# Altium schematic sheet Sheet1.SchDoc
size A
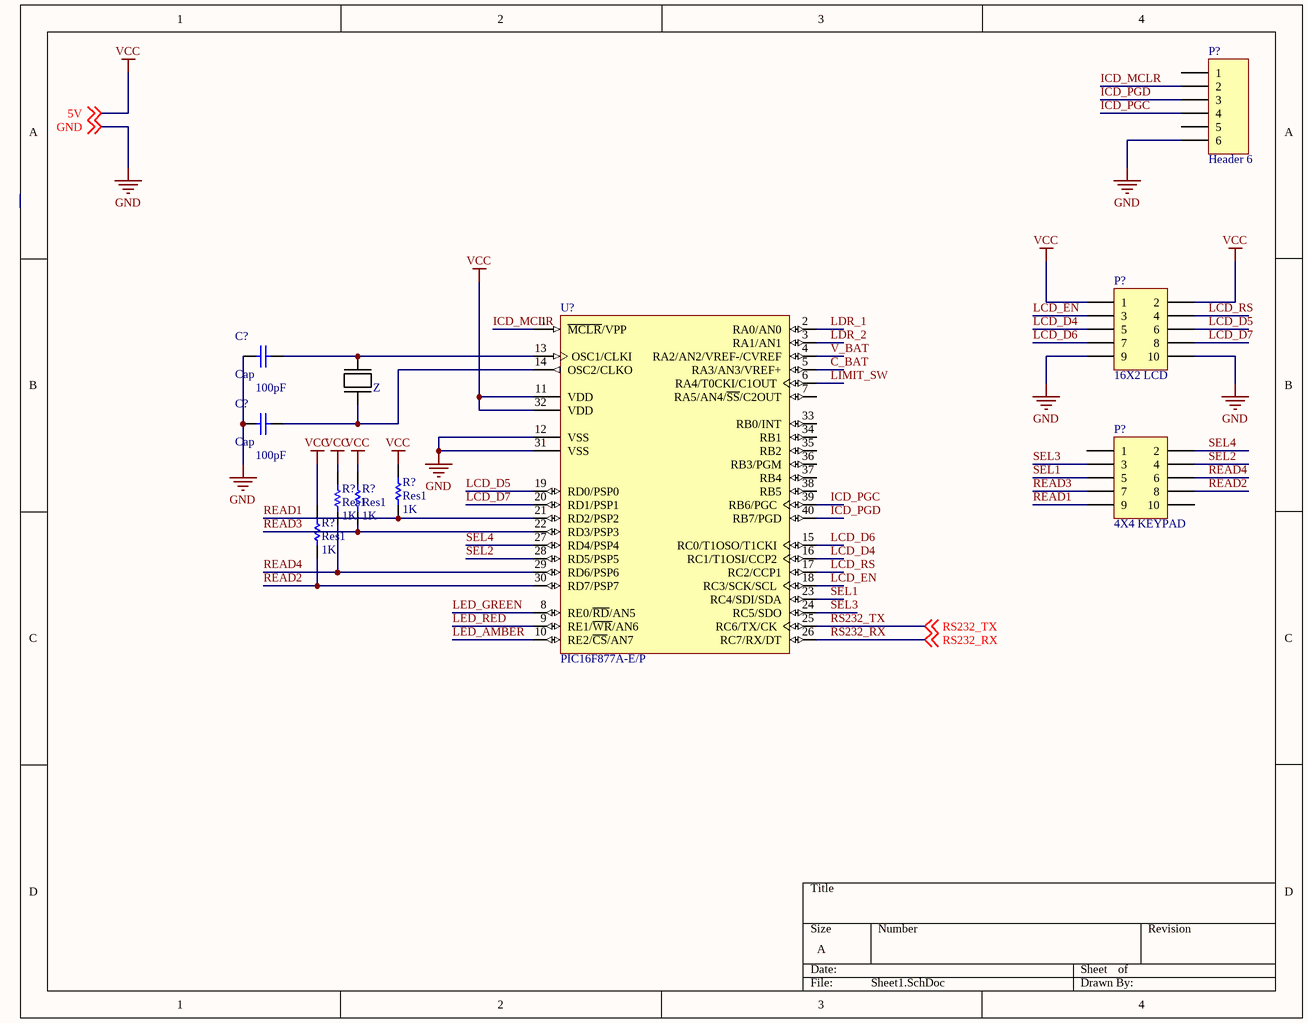
[diagram p0: Sheet1.SchDoc]

## Parts
(Parts that share a designator on the sheet are numbered #1, #2 ... from top to bottom, then left to right.)
C?#1  Cap  value 100pF  [RAD-0.3]
C?#2  Cap  value 100pF  [RAD-0.3]
P?#1  Header 6  [HDR1X6]
P?#2  16X2 LCD  [HDR2X5]
P?#3  4X4 KEYPAD  [HDR2X5]
R?#1  Res1  value 1K  [AXIAL-0.3]
R?#2  Res1  value 1K  [AXIAL-0.3]
R?#3  Res1  value 1K  [AXIAL-0.3]
R?#4  Res1  value 1K  [AXIAL-0.3]
U?  PIC16F877A-E/P  [PDIP600-P40]
Z  CRYSTAL  (value not drawn)

## Nets
GND: C?#1.1 C?#2.1 P?#1.6 P?#2.9 P?#2.10 U?.12(VSS) U?.31(VSS) ; off-sheet GND
VCC: P?#2.1 P?#2.2 R?#1.2 R?#2.2 R?#3.2 R?#4.2 U?.11(VDD) U?.32(VDD) ; off-sheet 5V  [also labelled 5V]
C_BAT: U?.5(RA3/AN3/VREF+)
ICD_MCLR: P?#1.2 U?.1(~{MCLR}/VPP)
ICD_PGC: P?#1.4 U?.39(RB6/PGC)
ICD_PGD: P?#1.3 U?.40(RB7/PGD)
LCD_D4: P?#2.5 U?.16(RC1/T1OSI/CCP2)
LCD_D5: P?#2.6 U?.19(RD0/PSP0)
LCD_D6: P?#2.7 U?.15(RC0/T1OSO/T1CKI)
LCD_D7: P?#2.8 U?.20(RD1/PSP1)
LCD_EN: P?#2.3 U?.18(RC3/SCK/SCL)
LCD_RS: P?#2.4 U?.17(RC2/CCP1)
LDR_1: U?.2(RA0/AN0)
LDR_2: U?.3(RA1/AN1)
LED_AMBER: U?.10(RE2/~{CS}/AN7)
LED_GREEN: U?.8(RE0/~{RD}/AN5)
LED_RED: U?.9(RE1/~{WR}/AN6)
LIMIT_SW: U?.6(RA4/T0CKI/C1OUT)
READ1: P?#3.9 R?#1.1 U?.21(RD2/PSP2)
READ2: P?#3.8 R?#4.1 U?.30(RD7/PSP7)
READ3: P?#3.7 R?#3.1 U?.22(RD3/PSP3)
READ4: P?#3.6 R?#2.1 U?.29(RD6/PSP6)
RS232_RX: U?.26(RC7/RX/DT) ; off-sheet RS232_RX
RS232_TX: U?.25(RC6/TX/CK) ; off-sheet RS232_TX
SEL1: P?#3.5 U?.23(RC4/SDI/SDA)
SEL2: P?#3.4 U?.28(RD5/PSP5)
SEL3: P?#3.3 U?.24(RC5/SDO)
SEL4: P?#3.2 U?.27(RD4/PSP4)
V_BAT: U?.4(RA2/AN2/VREF-/CVREF)
NetC?#1_2: C?#1.2 U?.13(OSC1/CLKI) Z.1
NetC?#2_2: C?#2.2 U?.14(OSC2/CLKO) Z.22

Not connected (* = marked no-connect by the designer): P?#1 1 5; P?#3 1 10; U? 7(RA5/AN4/~{SS}/C2OUT) 33(RB0/INT) 34(RB1) 35(RB2) 36(RB3/PGM) 37(RB4) 38(RB5)

## Library data of the parts
C?#1 C?#2 = Cap: Capacitor; Published: 8-Jun-2000; LatestRevisionDate: 17-Jul-2002; LatestRevisionNote: Re-released for DXP Platform.; PackageReference: RAD-0.3; Publisher: Altium Limited; PackageDescription: Radial Cap, Thru-Hole; 2 Leads; 0.3 in Pin Spacing
P?#1 = Header 6: Header, 6-Pin; LatestRevisionDate: 17-Jul-2002; LatestRevisionNote: Re-released for DXP Platform.; Publisher: Altium Limited
P?#2 P?#3 = Header 5X2: Header, 5-Pin, Dual row; LatestRevisionDate: 17-Jul-2002; LatestRevisionNote: Re-released for DXP Platform.; Publisher: Altium Limited
R?#1-R?#4 = Res1: Resistor; Published: 8-Jun-2000; LatestRevisionDate: 17-Jul-2002; LatestRevisionNote: Re-released for DXP Platform.; PackageReference: AXIAL-0.3; Publisher: Altium Limited; PackageDescription: Axial Device, Thru-Hole; 2 Leads; 0.3 in Pin Spacing
U? = PIC16F877A-E/P: Enhanced FLASH Microcontroller, 8K (x14-Bit words) FLASH, 368 Bytes RAM, 40-Pin PDIP, Standard VDD Range, Extended Temperature; ComponentAvailability: Unknown. Contact manufacturer to determine status.; Published: 11-Oct-2004; LatestRevisionDate: 29-Jan-2009; LatestRevisionNote: Sch. layout revised. 3D Model Removed.; DatasheetVersion: revB, Oct-2003; PackageVersion: revBB, Aug-2009; PackageReference: PDIP600-P40; Publisher: Altium Limited; PackageDescription: 40-Lead Plastic Dual In-Line (P) - 600 mil Body [PDIP]; Supplier 1: Digi-Key; Supplier Part Number 1: PIC16F877A-E/P-ND; Supplier 2: Farnell; Supplier Part Number 2: 1567990; ComponentLink1Description: Datasheet; ComponentLink1URL: http://ww1.microchip.com/downloads/en/DeviceDoc/39582b.pdf; ComponentLink2Description: Packaging Specification; ComponentLink2URL: http://www.microchip.com/stellent/groups/techpub_sg/documents/packagingspec/en012702.pdf; ComponentLink3Description: Microchip.com Home; ComponentLink3URL: http://www.microchip.com/